# Altium schematic sheet ZHSD-HDMI.SchDoc
size A3; DrawnBy: UGUR KELES; DocumentNumber: 15; SheetNumber: 15; SheetTotal: 17; Size: A3
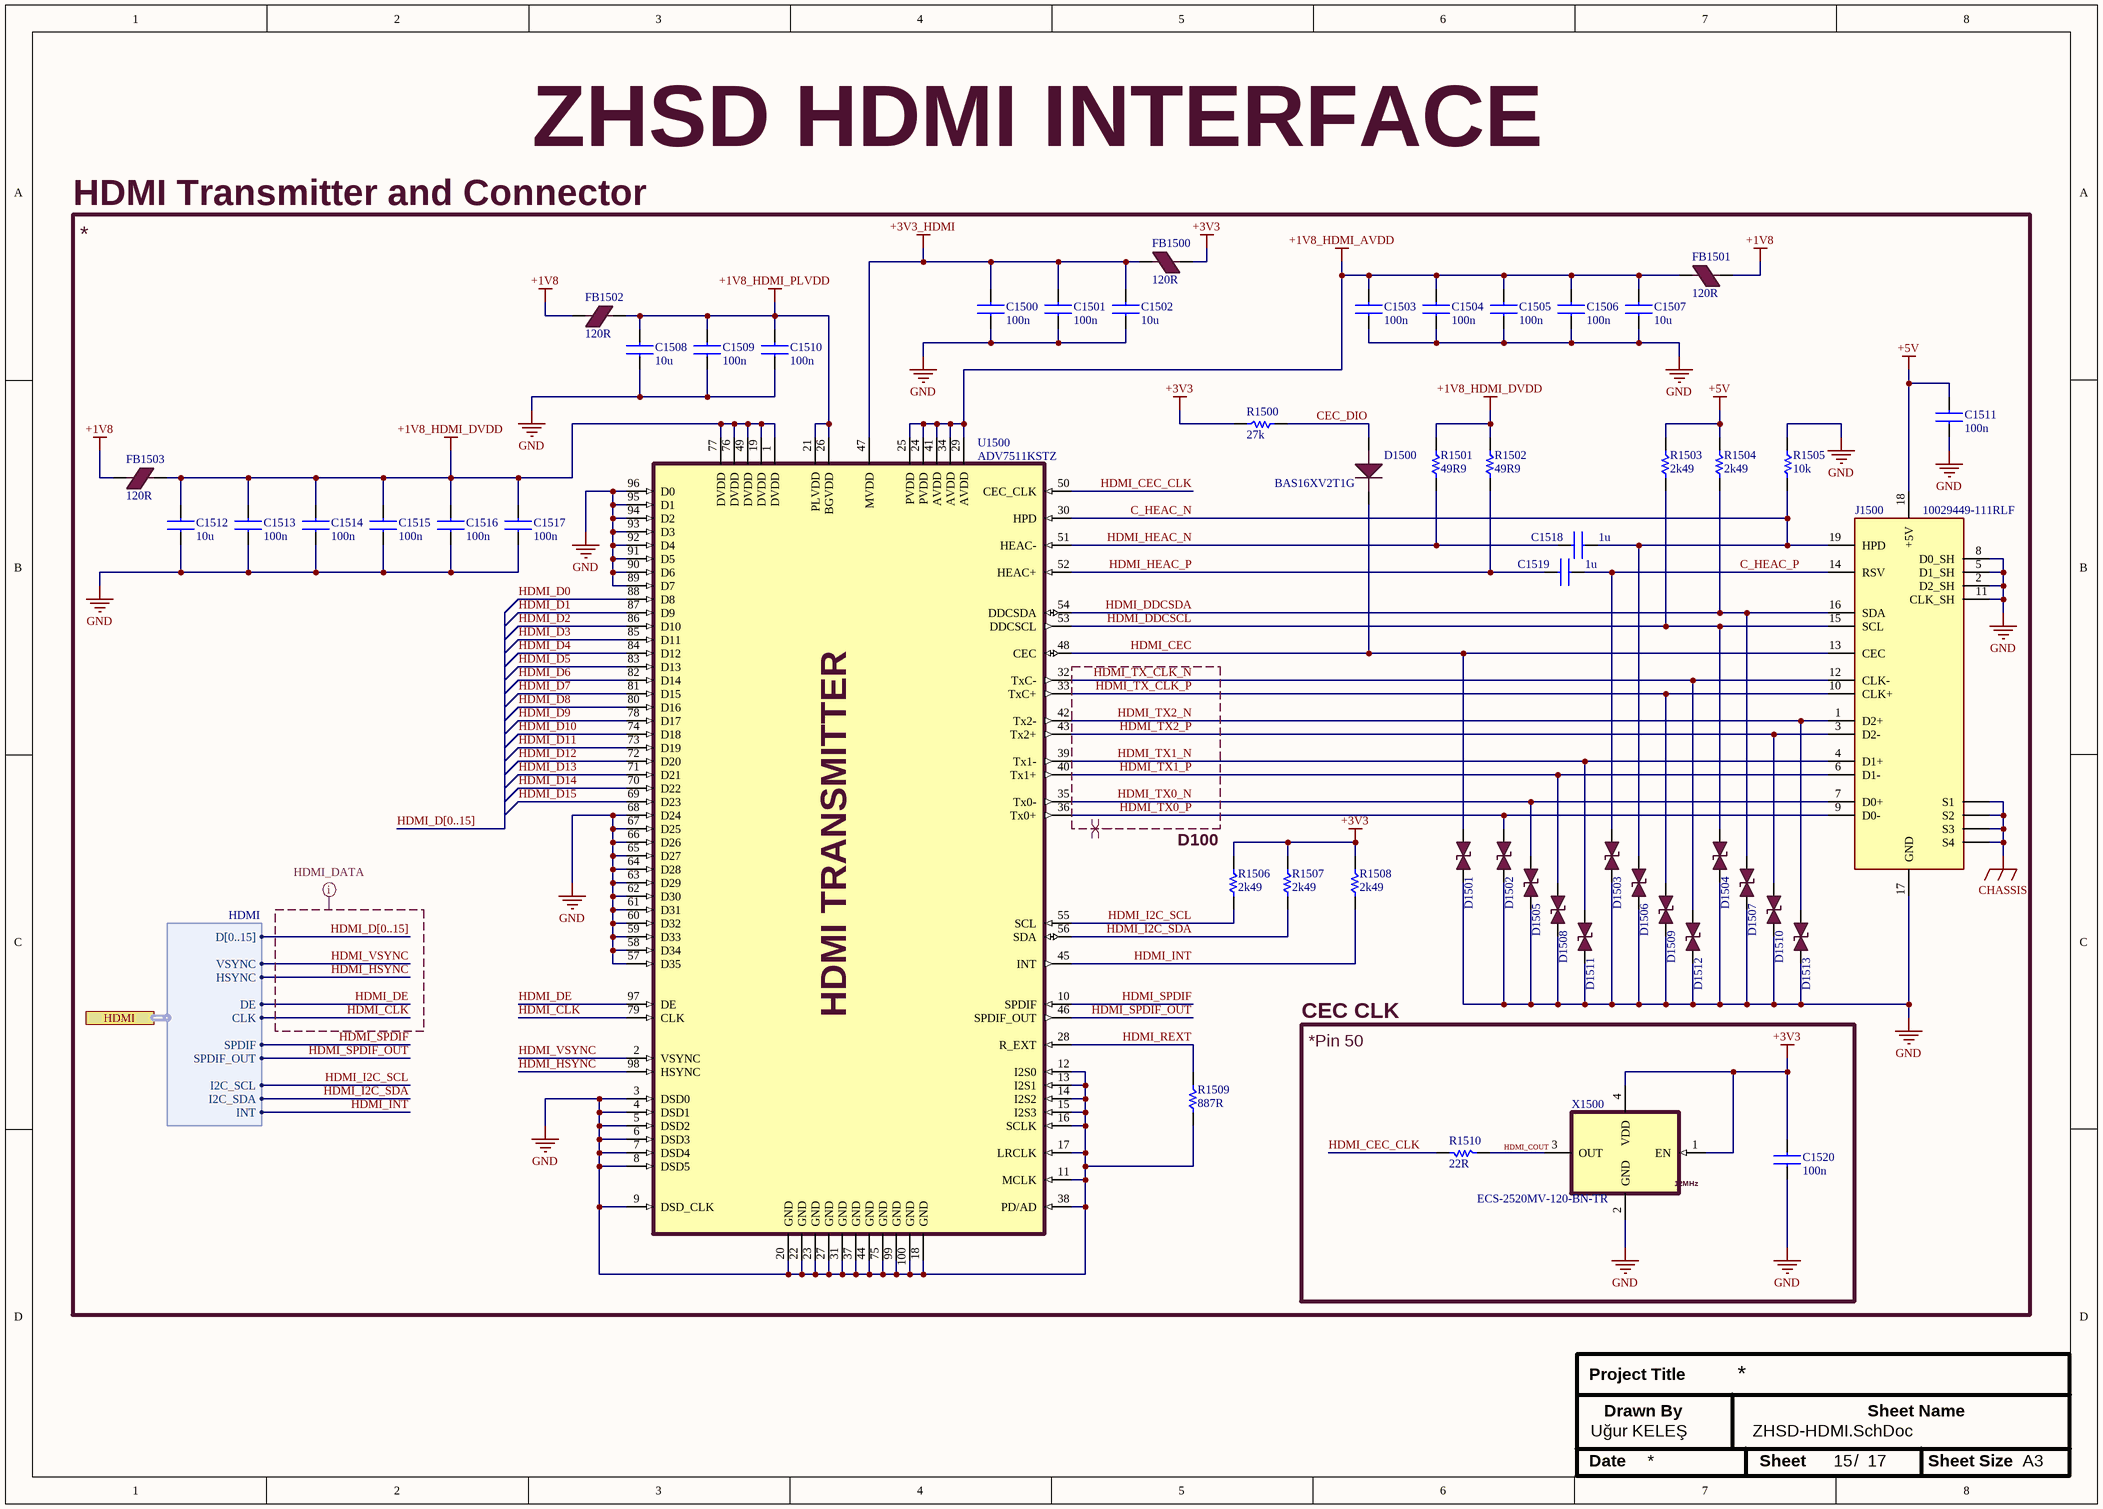
[diagram p0: ZHSD-HDMI.SchDoc]

## Parts
C1500  100n  [0603CAPC1608X09N]
C1501  100n  [0603CAPC1608X09N]
C1502  10u  [0603CAPC1608X09N]
C1503  100n  [0603CAPC1608X09N]
C1504  100n  [0603CAPC1608X09N]
C1505  100n  [0603CAPC1608X09N]
C1506  100n  [0603CAPC1608X09N]
C1507  10u  [0603CAPC1608X09N]
C1508  10u  [0603CAPC1608X09N]
C1509  100n  [0603CAPC1608X09N]
C1510  100n  [0603CAPC1608X09N]
C1511  100n  [0603CAPC1608X09N]
C1512  10u  [0603CAPC1608X09N]
C1513  100n  [0603CAPC1608X09N]
C1514  100n  [0603CAPC1608X09N]
C1515  100n  [0603CAPC1608X09N]
C1516  100n  [0603CAPC1608X09N]
C1517  100n  [0603CAPC1608X09N]
C1518  1u  [0603CAPC1608X09N]
C1519  1u  [0603CAPC1608X09N]
C1520  100n  [0603CAPC1608X09N]
D1500  BAS16XV2T1G  [SODFL160X50-2N]
D1501  B72590D0050H160  [0402DIOC1005X06N]  (value not drawn)
D1502  B72590D0050H160  [0402DIOC1005X06N]  (value not drawn)
D1503  B72590D0050H160  [0402DIOC1005X06N]  (value not drawn)
D1504  B72590D0050H160  [0402DIOC1005X06N]  (value not drawn)
D1505  B72590D0050H160  [0402DIOC1005X06N]  (value not drawn)
D1506  B72590D0050H160  [0402DIOC1005X06N]  (value not drawn)
D1507  B72590D0050H160  [0402DIOC1005X06N]  (value not drawn)
D1508  B72590D0050H160  [0402DIOC1005X06N]  (value not drawn)
D1509  B72590D0050H160  [0402DIOC1005X06N]  (value not drawn)
D1510  B72590D0050H160  [0402DIOC1005X06N]  (value not drawn)
D1511  B72590D0050H160  [0402DIOC1005X06N]  (value not drawn)
D1512  B72590D0050H160  [0402DIOC1005X06N]  (value not drawn)
D1513  B72590D0050H160  [0402DIOC1005X06N]  (value not drawn)
FB1500  120R  [0603INDC1608X08N]
FB1501  120R  [0603INDC1608X08N]
FB1502  120R  [0603INDC1608X08N]
FB1503  120R  [0603INDC1608X08N]
J1500  10029449-111RLF  [AMPHENOL_10029449-111RLF]
R1500  27k  [0402RESC1005X04N]
R1501  49R9  [0402RESC1005X04N]
R1502  49R9  [0402RESC1005X04N]
R1503  2k49  [0402RESC1005X04N]
R1504  2k49  [0402RESC1005X04N]
R1505  10k  [0603RESC1608X05N]
R1506  2k49  [0402RESC1005X04N]
R1507  2k49  [0402RESC1005X04N]
R1508  2k49  [0402RESC1005X04N]
R1509  887R  [0603RESC1608X05N]
R1510  22R  [0603RESC1608X05N]
U1500  ADV7511KSTZ  [LQFP50P1600X1600X160-100N]
X1500  ECS-2520MV-120-BN-TR  [XTAL_2520]

## Blocks framed on the sheet
HDMI Transmitter and Connector: C1500-C1519 D1500-D1513 FB1500-FB1503 J1500 R1500-R1509 U1500
CEC CLK: C1520 R1510 X1500

## Ports
HDMI (harness HDMI, see ZHSD-Block[3600,1600], ZHSD-ZYNQ-PL[3900,2700])

## Harnesses
HDMI: SPDIF, SPDIF_OUT, VSYNC, HSYNC, DE, CLK, INT, I2C_SCL, I2C_SDA, D[0..15]

## Nets
+1V8: FB1501.1 FB1502.1 FB1503.1
+1V8_HDMI_AVDD: C1503.2 C1504.2 C1505.2 C1506.2 C1507.2 FB1501.2 U1500.24(PVDD) U1500.25(PVDD) U1500.29(AVDD) U1500.34(AVDD) U1500.41(AVDD)
+1V8_HDMI_DVDD: C1512.2 C1513.2 C1514.2 C1515.2 C1516.2 C1517.2 FB1503.2 R1501.2 R1502.2 U1500.1(DVDD) U1500.19(DVDD) U1500.49(DVDD) U1500.76(DVDD) U1500.77(DVDD)
+1V8_HDMI_PLVDD: C1508.2 C1509.2 C1510.2 FB1502.2 U1500.21(PLVDD) U1500.26(BGVDD)
+3V3: C1520.2 FB1500.1 R1500.2 R1506.2 R1507.2 R1508.2 X1500.1(EN) X1500.4(VDD)
+3V3_HDMI: C1500.2 C1501.2 C1502.2 FB1500.2 U1500.47(MVDD)
+5V: C1511.2 J1500.18(+5V) R1503.2 R1504.2
CHASSIS: J1500.S1 J1500.S2 J1500.S3 J1500.S4
GND: C1500.1 C1501.1 C1502.1 C1503.1 C1504.1 C1505.1 C1506.1 C1507.1 C1508.1 C1509.1 C1510.1 C1511.1 C1512.1 C1513.1 C1514.1 C1515.1 C1516.1 C1517.1 C1520.1 D1501.1 D1502.1 D1503.1 D1504.1 D1505.1 D1506.1 D1507.1 D1508.1 D1509.1 D1510.1 D1511.1 D1512.1 D1513.1 J1500.2(D2_SH) J1500.5(D1_SH) J1500.8(D0_SH) J1500.11(CLK_SH) J1500.17(GND) R1505.1 R1509.1 U1500.3(DSD0) U1500.4(DSD1) U1500.5(DSD2) U1500.6(DSD3) U1500.7(DSD4) U1500.8(DSD5) U1500.9(DSD_CLK) U1500.11(MCLK) U1500.12(I2S0) U1500.13(I2S1) U1500.14(I2S2) U1500.15(I2S3) U1500.16(SCLK) U1500.17(LRCLK) U1500.18(GND) U1500.20(GND) U1500.22(GND) U1500.23(GND) U1500.27(GND) U1500.31(GND) U1500.37(GND) U1500.38(PD/AD) U1500.44(GND) U1500.57(D35) U1500.58(D34) U1500.59(D33) U1500.60(D32) U1500.61(D31) U1500.62(D30) U1500.63(D29) U1500.64(D28) U1500.65(D27) U1500.66(D26) U1500.67(D25) U1500.68(D24) U1500.75(GND) U1500.89(D7) U1500.90(D6) U1500.91(D5) U1500.92(D4) U1500.93(D3) U1500.94(D2) U1500.95(D1) U1500.96(D0) U1500.99(GND) U1500.100(GND) X1500.2(GND)
C_HEAC_N: C1518.2 D1506.2 J1500.19(HPD) R1505.2 U1500.30(HPD)
C_HEAC_P: C1519.2 D1503.2 J1500.14(RSV)
CEC_DIO: D1500.A R1500.1
HDMI_CEC: D1500.C D1501.2 J1500.13(CEC) U1500.48(CEC)
HDMI_CEC_CLK: R1510.1 U1500.50(CEC_CLK)
HDMI_CLK: U1500.79(CLK) ; port HDMI.CLK
HDMI_COUT: R1510.2 X1500.3(OUT)
HDMI_D0: U1500.88(D8)
HDMI_D1: U1500.87(D9)
HDMI_D2: U1500.86(D10)
HDMI_D3: U1500.85(D11)
HDMI_D4: U1500.84(D12)
HDMI_D5: U1500.83(D13)
HDMI_D6: U1500.82(D14)
HDMI_D7: U1500.81(D15)
HDMI_D8: U1500.80(D16)
HDMI_D9: U1500.78(D17)
HDMI_D10: U1500.74(D18)
HDMI_D11: U1500.73(D19)
HDMI_D12: U1500.72(D20)
HDMI_D13: U1500.71(D21)
HDMI_D14: U1500.70(D22)
HDMI_D15: U1500.69(D23)
HDMI_DDCSCL: D1504.2 J1500.15(SCL) R1503.1 U1500.53(DDCSCL)
HDMI_DDCSDA: D1507.2 J1500.16(SDA) R1504.1 U1500.54(DDCSDA)
HDMI_DE: U1500.97(DE) ; port HDMI.DE
HDMI_HEAC_N: C1518.1 R1501.1 U1500.51(HEAC-)
HDMI_HEAC_P: C1519.1 R1502.1 U1500.52(HEAC+)
HDMI_HSYNC: U1500.98(HSYNC) ; port HDMI.HSYNC
HDMI_I2C_SCL: R1506.1 U1500.55(SCL) ; port HDMI.I2C_SCL
HDMI_I2C_SDA: R1507.1 U1500.56(SDA) ; port HDMI.I2C_SDA
HDMI_INT: R1508.1 U1500.45(INT) ; port HDMI.INT
HDMI_REXT: R1509.2 U1500.28(R_EXT)
HDMI_SPDIF: U1500.10(SPDIF) ; port HDMI.SPDIF
HDMI_SPDIF_OUT: U1500.46(SPDIF_OUT) ; port HDMI.SPDIF_OUT
HDMI_TX0_N: D1505.2 J1500.7(D0+) U1500.35(Tx0-)
HDMI_TX0_P: D1502.2 J1500.9(D0-) U1500.36(Tx0+)
HDMI_TX1_N: D1511.2 J1500.4(D1+) U1500.39(Tx1-)
HDMI_TX1_P: D1508.2 J1500.6(D1-) U1500.40(Tx1+)
HDMI_TX2_N: D1513.2 J1500.1(D2+) U1500.42(Tx2-)
HDMI_TX2_P: D1510.2 J1500.3(D2-) U1500.43(Tx2+)
HDMI_TX_CLK_N: D1512.2 J1500.12(CLK-) U1500.32(TxC-)
HDMI_TX_CLK_P: D1509.2 J1500.10(CLK+) U1500.33(TxC+)
HDMI_VSYNC: U1500.2(VSYNC) ; port HDMI.VSYNC

## Buses and harness runs
bus HDMI_D[0..15]

## Layout directives
differential pair; differential pair class HDMI_DIFF; rule Differential Pairs Routing [Pref Gap = 10mil    Min Gap  = 5mil    Max Gap  = 10milPref Width = 3.937mil    Min Width  = 3.543mil    Max Width  = 3.937mil]: HDMI_TX0_N, HDMI_TX0_P, HDMI_TX1_N, HDMI_TX1_P, HDMI_TX2_N, HDMI_TX2_P, HDMI_TX_CLK_N, HDMI_TX_CLK_P
net class HDMI_DATA; rule Matched Net Lengths [Delay Tolerance = 10ps]: HDMI_CLK, HDMI_D[0..15], HDMI_DE, HDMI_HSYNC, HDMI_VSYNC

## Notes on the sheet
- ZHSD HDMI INTERFACE
- *
- (near R1506) D100
- *Pin 50
- Project Title
- Uğur KELEŞ
- Drawn By
- Sheet Name
- Date
- Sheet
- /
- Sheet Size
- A3
- (in symbol ADV7511KSTZ) HDMI TRANSMITTER
- (in symbol ECS-2520MV-120-BN-TR) 12MHz

## Library data of the parts
C1500 C1501 C1503-C1506 C1509-C1511 C1513-C1517 = GRM155R71C104KA88J: CAP CER 0.1UF 16V X7R 0402 (1005) ±10%; Manufacturer: Murata Electronics; Value: 0.1 µF; ComponentLink1Description: Datasheet; ComponentLink1URL: https://search.murata.co.jp/Ceramy/image/img/A01X/G101/ENG/GRM155R71C104KA88-01.pdf; MPN: GRM155R71C104KA88J; Package: 0402; Tolerance: ±10%; Voltage: 16V
C1502 C1507 C1508 C1512 = GRM188Z71A106MA73D: CAP CER 10UF 10V X7R 0603 (1608) ±20%; Manufacturer: Murata Electronics; Value: 10 µF; ComponentLink1Description: Datasheet; ComponentLink1URL: https://search.murata.co.jp/Ceramy/image/img/A01X/G101/ENG/GRM188Z71A106MA73-01A.pdf; MPN: GRM188Z71A106MA73D; Package: 0603; Tolerance: ±20%; Voltage: 10V
C1518 C1519 = GRM188R61E105KA12D: CAP CER 1UF 25V X5R 0603 (1608) ±10%; Manufacturer: Murata Power Solutions Inc.; Value: 1 µF; ComponentLink1Description: Datasheet; ComponentLink1URL: https://search.murata.co.jp/Ceramy/image/img/A01X/G101/ENG/GRM188R61E105KA12-01.pdf; MPN: GRM188R61E105KA12D; Package: 0603; Tolerance: ±10%; Voltage: 25V
C1520 = C0603C104K5RACTU: CAP CER 0.1UF 50V X7R 0603 (1608) ±10%; Manufacturer: KEMET; Value: 0.1 µF; ComponentLink1Description: Datasheet; ComponentLink1URL: https://yageogroup.com/content/datasheet/asset/file/KEM_C1002_X7R_SMD; MPN: C0603C104K5RACTU; Package: 0603; Tolerance: ±10%; Voltage: 50V
D1500 = BAS16XV2T1G: DIODE STANDARD 100V 200MA SOD523; Manufacturer: onsemi; ComponentLink1Description: Datasheet; ComponentLink1URL: https://www.onsemi.com/pdf/datasheet/bas16xv2t1-d.pdf; MPN: BAS16XV2T1G; Package: SOD-523
D1501-D1513 = B72590D0050H160: Varistor 1 Circuit Surface Mount, MLCV 0402 (1005 Metric); Manufacturer: EPCOS - TDK Electronics; ComponentLink1Description: Datasheet; ComponentLink1URL: https://www.tdk-electronics.tdk.com/inf/75/ds/High_speed_series.pdf?ref_disty=digikey; MPN: B72590D0050H160; Package: 0402
FB1500-FB1503 = BLM18SG121TN1D: FERRITE BEAD 120 OHM 0603 (1608) 3A 25mOhm; Manufacturer: Murata Electronics; Impedance @ Frequency: 120 Ohms @ 100 MHz; ComponentLink1Description: Datasheet; ComponentLink1URL: https://pim.murata.com/asset/pim4/ferriteBeadInductortypefilter/ENFA0003_PDF_FERRITEBEADINDUCTORTYPEFILTER?lastModifiedDatetime=20250707190934; ComponentLink2Description: Website; ComponentLink2URL: https://pim.murata.com/en-global/pim/details/?partNum=BLM18SG121TN1%23; Current Rating (Max): 3A; DC Resistance (DCR) (Max): 25mOhm; MPN: BLM18SG121TN1D; Package: 0603
J1500 = 10029449-111RLF: CONN RCPT 1.4 HDMI 19POS SMD R/A; Manufacturer: Amphenol ICC (FCI); ComponentLink1Description: Datasheet; ComponentLink1URL: https://cdn.amphenol-cs.com/media/wysiwyg/files/documentation/datasheet/inputoutput/io_hdmi_receptacles.pdf; ComponentLink2Description: Drawing; ComponentLink2URL: https://cdn.amphenol-cs.com/media/wysiwyg/files/drawing/10029449.pdf; ComponentLink3Description: Product Specification; ComponentLink3URL: https://cdn.amphenol-cs.com/media/wysiwyg/files/documentation/gs-12-309.pdf; MPN: 10029449-111RLF
R1500 = RC0402FR-0727KL: RES 27K OHM 1% 1/16W 0402 (1005); Manufacturer: YAGEO; Value: 27 kOhms; Voltage: 50V; ComponentLink1Description: Datasheet; ComponentLink1URL: https://yageogroup.com/content/datasheet/asset/file/PYU-RC_GROUP_51_ROHS_L; MPN: RC0402FR-0727KL; Tolerance: ±1%; Package: 0402
R1501 R1502 = RC0402FR-0749R9L: RES 49.9 OHM 1% 1/16W 0402 (1005); Manufacturer: YAGEO; Value: 49.9 Ohms; Voltage: 50V; ComponentLink1Description: Datasheet; ComponentLink1URL: https://yageogroup.com/content/datasheet/asset/file/PYU-RC_GROUP_51_ROHS_L; MPN: RC0402FR-0749R9L; Tolerance: ±1%; Package: 0402
R1503 R1504 R1506-R1508 = RC0402FR-132K49L: RES 2.49K OHM 1% 1/16W 0402 (1005); Manufacturer: YAGEO; Value: 2.49 kOhms; Voltage: 50V; ComponentLink1Description: Datasheet; ComponentLink1URL: https://yageogroup.com/content/datasheet/asset/file/PYU-RC_GROUP_51_ROHS_L; MPN: RC0402FR-132K49L; Tolerance: ±1%; Package: 0402
R1505 = RC0603FR-0710KL: RES 10K OHM 1% 1/10W 0603(1608); Manufacturer: YAGEO; Value: 10 kOhms; Voltage: 75V; ComponentLink1Description: Datasheet; ComponentLink1URL: https://yageogroup.com/content/datasheet/asset/file/PYU-RC_GROUP_51_ROHS_L; MPN: RC0603FR-0710KL; Tolerance: ±1%; Package: 0603
R1509 = RC0603FR-07887RL: RES 887 OHM 1% 1/10W 0603 (1608); Manufacturer: YAGEO; Value: 887 Ohms; Voltage: 75V; ComponentLink1Description: Datasheet; ComponentLink1URL: https://yageogroup.com/content/datasheet/asset/file/PYU-RC_GROUP_51_ROHS_L; MPN: RC0603FR-07887RL; Tolerance: ±1%; Package: 0603
R1510 = RC0603FR-0722RL: RES 22 OHM 1% 1/10W 0603 (1608); Manufacturer: YAGEO; Value: 22 Ohms; Voltage: 75V; ComponentLink1Description: Datasheet; ComponentLink1URL: https://yageogroup.com/content/datasheet/asset/file/PYU-RC_GROUP_51_ROHS_L; MPN: RC0603FR-0722RL; Tolerance: ±1%; Package: 0603
U1500 = ADV7511KSTZ: 225 MHz, High Performance HDMI® Transmitter with ARC; Manufacturer: Analog Devices Inc./Maxim Integrated; ComponentLink1Description: Datasheet; ComponentLink1URL: https://www.analog.com/media/en/technical-documentation/data-sheets/ADV7511.pdf; ComponentLink2Description: Hardware User's Guide; ComponentLink2URL: https://www.analog.com/media/en/technical-documentation/user-guides/ADV7511_Hardware_Users_Guide.pdf; ComponentLink3Description: HDMI-Enabled Designs Using the ADV7511; ComponentLink3URL: https://www.analog.com/media/en/technical-documentation/evaluation-documentation/hdmi-enabled_designs_using_adv7511.pdf; ComponentLink4Description: Design Support Files; ComponentLink4URL: https://ez.analog.com/video/w/documents/794/adv7511-design-support-files; MPN: ADV7511KSTZ
X1500 = ECS-2520MV-120-BN-TR: XTAL OSC XO 12.0000MHZ CMOS SMD; Manufacturer: ECS Inc.; ComponentLink1Description: Datasheet; ComponentLink1URL: https://ecsxtal.com/store/pdf/ECS-2520MV.pdf; MPN: ECS-2520MV-120-BN-TR